# EAGLE design rgbboard (EAGLE 7.7.0)
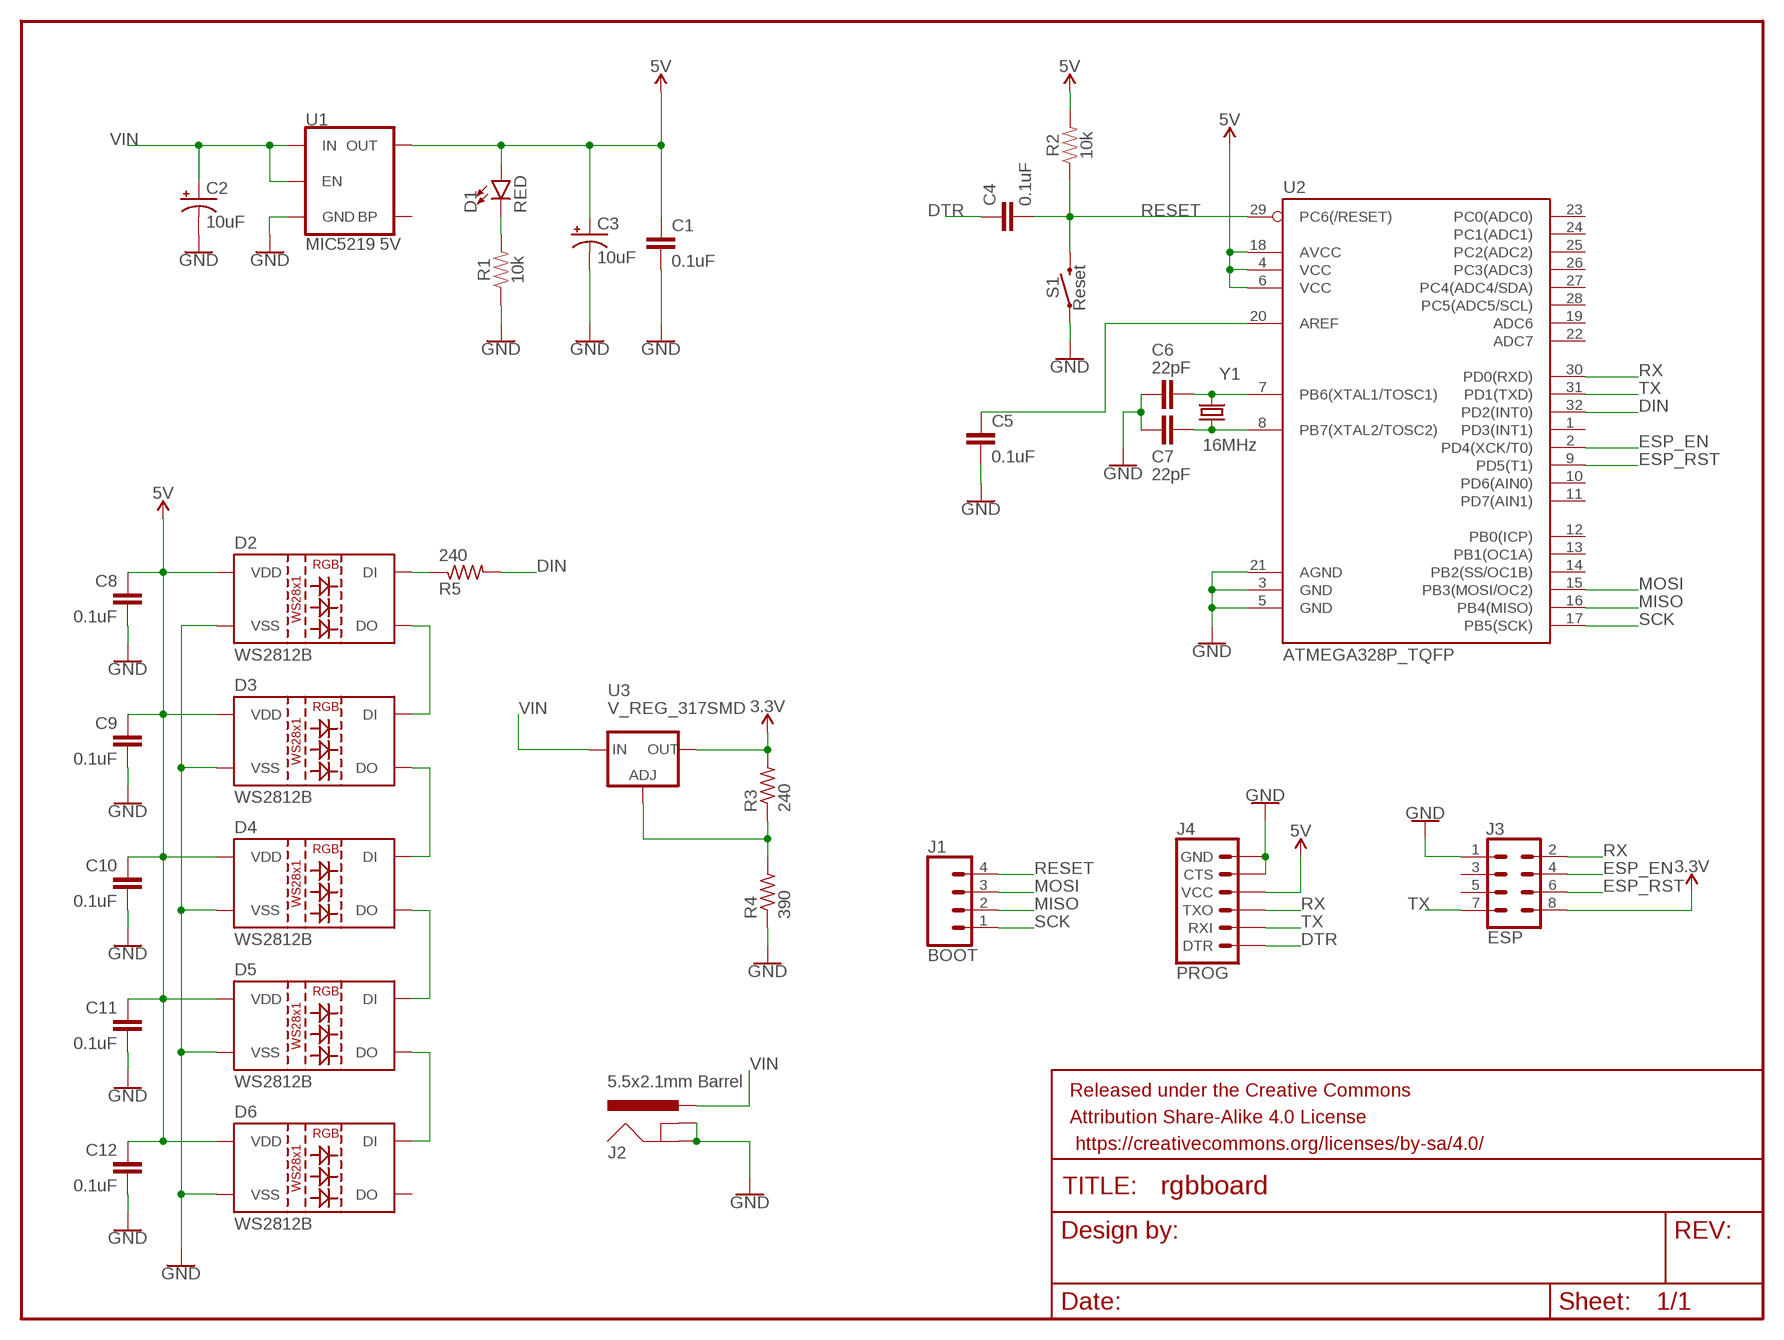
[diagram p0: schematic, sheet 1]

## Parts
C1  0.1uF  0.1UF-0603-25V-5%  [0603]
C2  10uF  10UF-POLAR-EIA3216-16V-10%(TANT)  [EIA3216]
C3  10uF  10UF-POLAR-EIA3216-16V-10%(TANT)  [EIA3216]
C4  0.1uF  0.1UF-0603-25V-5%  [0603]
C5  0.1uF  0.1UF-0603-25V-5%  [0603]
C6  22pF  22PF-0603-50V-5%  [0603]
C7  22pF  22PF-0603-50V-5%  [0603]
C8  0.1uF  0.1UF-0603-25V-5%  [0603]
C9  0.1uF  0.1UF-0603-25V-5%  [0603]
C10  0.1uF  0.1UF-0603-25V-5%  [0603]
C11  0.1uF  0.1UF-0603-25V-5%  [0603]
C12  0.1uF  0.1UF-0603-25V-5%  [0603]
D1  RED  LED-RED0603  [LED-0603]
D2  WS2812B  [WS2812B]
D3  WS2812B  [WS2812B]
D4  WS2812B  [WS2812B]
D5  WS2812B  [WS2812B]
D6  WS2812B  [WS2812B]
FRAME1  FRAME-LETTER  [CREATIVE_COMMONS]
J1  BOOT  CONN_04  [1X04]
J2  5.5x2.1mm Barrel  POWER_JACKSMD  [POWER_JACK_SMD]
J3  ESP  CONN_04X2  [2X4]
J4  PROG  6_PIN_SERIAL_TARGET  [1X06]
R1  10k  10KOHM-0603-1/10W-1%  [0603]
R2  10k  10KOHM-0603-1/10W-1%  [0603]
R3  240  R-US_R0603  [R0603]
R4  390  R-US_R0603  [R0603]
R5  240  R-US_R0603  [R0603]
S1  Reset  MOMENTARY-SWITCH-SPST-SMD-5.2-REDUNDANT  [TACTILE_SWITCH_SMD_5.2MM]
U1  MIC5219 5V  V_REG_MIC52195V  [SOT23-5]
U2  ATMEGA328P_TQFP  [TQFP32-08]
U3  V_REG_317SMD  [SOT223]
Y1  16MHz  CRYSTAL-16MHZSMD-5X3.2  [CRYSTAL-SMD-5X3.2-4PAD]

## Nets
3.3V: J3.8 R3.2 U3.2(OUT)
5V: C1.1 C3.+ C8.1 C9.1 C10.1 C11.1 C12.1 D1.A D2.1(VDD) D3.1(VDD) D4.1(VDD) D5.1(VDD) D6.1(VDD) J4.4(VCC) R2.2 U1.5(OUT) U2.4(VCC) U2.6(VCC) U2.18(AVCC)
DIN: R5.2 U2.32(PD2(INT0))
DTR: C4.1 J4.1(DTR)
ESP_EN: J3.4 U2.2(PD4(XCK/T0))
ESP_RST: J3.6 U2.9(PD5(T1))
GND: C1.2 C2.- C3.- C5.2 C6.1 C7.1 C8.2 C9.2 C10.2 C11.2 C12.2 D2.3(VSS) D3.3(VSS) D4.3(VSS) D5.3(VSS) D6.3(VSS) J2.GND(GNDBREAK) J2.P$4(GND) J3.1 J4.5(CTS) J4.6(GND) R1.1 R4.1 S1.1 S1.2 U1.2(GND) U2.3(GND) U2.5(GND) U2.21(AGND)
MISO: J1.2 U2.16(PB4(MISO))
MOSI: J1.3 U2.15(PB3(MOSI/OC2))
N$1: D2.2(DO) D3.4(DI)
N$2: D1.C R1.2
N$3: D3.2(DO) D4.4(DI)
N$4: D4.2(DO) D5.4(DI)
N$5: D5.2(DO) D6.4(DI)
N$7: C5.1 U2.20(AREF)
N$8: C6.2 U2.7(PB6(XTAL1/TOSC1)) Y1.3
N$9: C7.2 U2.8(PB7(XTAL2/TOSC2)) Y1.1
N$10: R3.1 R4.2 U3.1(ADJ)
N$11: D2.4(DI) R5.1
RESET: C4.2 J1.4 R2.1 S1.3 S1.4 U2.29(PC6(/RESET))
RX: J3.2 J4.3(TXO) U2.30(PD0(RXD))
SCK: J1.1 U2.17(PB5(SCK))
TX: J3.7 J4.2(RXI) U2.31(PD1(TXD))
VIN: C2.+ J2.VIN0(PWR) U1.1(IN) U1.3(EN) U3.3(IN)
Unconnected: D6.2(DO) J3.3 J3.5 U1.4(BP) U2.1(PD3(INT1)) U2.10(PD6(AIN0)) U2.11(PD7(AIN1)) U2.12(PB0(ICP)) U2.13(PB1(OC1A)) U2.14(PB2(SS/OC1B)) U2.19(ADC6) U2.22(ADC7) U2.23(PC0(ADC0)) U2.24(PC1(ADC1)) U2.25(PC2(ADC2)) U2.26(PC3(ADC3)) U2.27(PC4(ADC4/SDA)) U2.28(PC5(ADC5/SCL))

## Library data of the parts
C1 C4 C5 C8-C12 = SparkFun-Capacitors:0.1UF: 0.1µF ceramic capacitors A capacitor is a passive two-terminal electrical component used to store electrical energy temporarily in an electric field.; PROD_ID: CAP-08604
C2 C3 = SparkFun-Capacitors:10UF-POLAR: 10.0µF polarized capacitors A capacitor is a passive two-terminal electrical component used to store electrical energy temporarily in an electric field.; PROD_ID: CAP-00811
C6 C7 = SparkFun-Capacitors:22PF: 22pF ceramic capacitors A capacitor is a passive two-terminal electrical component used to store electrical energy temporarily in an electric field.; PROD_ID: CAP-07876
D1 = SparkFun-LED:LED-RED: Red SMD LED Used in manufacturing of most products at SparkFun Packages: 0603 - SMD 0603 package [Product Link] <http://docs.avagotech.com/docs/AV02-0551EN> 0603 SMART - SMD 0603 SMART package ( more efficient and expensive)[Product Link] <http://www.osram-os.com/Graphics/XPic2/00077099_0.pdf> 1206 - SMD1206 package [Product Link] <https://www.sparkfun.com/datasheets/DevTools/LilyPad/Q150OVS4.pdff> SparkFun Products: Pro Mini 328 -5V <https://www.sparkfun.com/products/821> RedBoard <https://www.sparkfun.com/products/12757> IOIO-OTG <https://www.sparkfun.com/products/13613>; PROD_ID: DIO-00819
D2-D6 = SparkFun-LED:WS2812B: WS2812B SMD addressable RGB LED 5x5mm SMD LED with built-in controller IC. Color: Red/Green/Blue mC Rating: RGB: 390, 660, 180 mcd Forward Voltage: RGB: 2.0, 3.0, 3.0 V Packages:WS2812B SparkFun Products: Blynk Board - ESP8266 <https://www.sparkfun.com/products/13794>; PROD_ID: DIO-12503
FRAME1 = SparkFun-Aesthetics:FRAME-LETTER: Schematic Frame - Letter Standard 8.5x11 US Letter frame
J1 = SparkFun-Connectors:CONN_04: Multi connection point. Often used as Generic Header-pin footprint for 0.1 inch spaced/style header connections On any of the 0.1 inch spaced packages, you can populate with these: Break Away Headers - Straight <https://www.sparkfun.com/products/116> (PRT-00116) Break Away Male Headers - Right Angle <https://www.sparkfun.com/products/553> (PRT-00553) Female Headers <https://www.sparkfun.com/products/115> (PRT-00115) Break Away Headers - Machine Pin <https://www.sparkfun.com/products/117> (PRT-00117) Break Away Female Headers - Swiss Machine Pin <https://www.sparkfun.com/products/743> (PRT-00743) For SCREWTERMINALS and SPRING TERMINALS visit here: Screw Terimnals on SparkFun.com <https://www.sparkfun.com/search/results?term=Screw+Terminals> (5mm/3.5mm/2.54mm spacing) This device is also useful as a general connection point to wire up your design to another part of your project. Our various solder wires solder well into these plated through hole pads. Hook-Up Wire - Assortment (Stranded, 22 AWG) <https://www.sparkfun.com/products/11375> (PRT-11375) Hook-Up Wire - Assortment (Solid Core, 22 AWG) <https://www.sparkfun.com/products/11367> (PRT-11367) View the entire wire category on our website here <https://www.sparkfun.com/categories/141> Special notes: Molex polarized connector foot print use with SKU : PRT-08231 with associated crimp pins and housings. 1MM SMD Version SKU: PRT-10208; PROD_ID: CONN-09696
J2 = SparkFun-Connectors:POWER_JACK: Power Jack Connector This is the standard 5.5mm barrel jack for power. The PTH is the most common, proven, reliable, footprint. The Slot footprint only works if the mill layer is transmitted to the PCB fab house so be warned. Here are the connectors we sell at SparkFun: DC Barrel Power Jack/Connector <https://www.sparkfun.com/products/119> (PRT-00119) DC Barrel Power Jack/Connector (SMD) <https://www.sparkfun.com/products/12748> (PRT-12748) DC Barrel Jack Adapter - Breadboard Compatible <https://www.sparkfun.com/products/10811> (PRT-10811) It is used on this SparkFun product (and many, many others): SparkFun RedBoard - Programmed with Arduino <https://www.sparkfun.com/products/12757> (DEV-12757) Also, if you need a mating power supply or connector, please check these out: Wall Adapter Power Supply - 9VDC 650mA <https://www.sparkfun.com/products/298> (TOL-00298) DC Barrel Jack Adapter - Male <https://www.sparkfun.com/products/10287> (PRT-10287); PROD_ID: CONN-08106; SF_ID: PRT-12748
J3 = SparkFun-Connectors:CONN_04X2: Multi connection point. Often used as Generic Header-pin footprint for 0.1 inch spaced/style header connections On any of the 0.1 inch spaced packages, you can populate with these: Break Away Headers - Straight <https://www.sparkfun.com/products/116> (PRT-00116) Break Away Male Headers - Right Angle <https://www.sparkfun.com/products/553> (PRT-00553) Female Headers <https://www.sparkfun.com/products/115> (PRT-00115) Break Away Headers - Machine Pin <https://www.sparkfun.com/products/117> (PRT-00117) Break Away Female Headers - Swiss Machine Pin <https://www.sparkfun.com/products/743> (PRT-00743)
J4 = SparkFun-Connectors:6_PIN_SERIAL_TARGET: 6-pin header connection for use with the "FTDI BASIC" pinout - TARGET SIDE. Also known as "Arduino Serial Program Header". It is used to mate with our FTDI Basic serial programmers using the Arduino IDE. Note, this device has "TARGET" in the name. It is intended to be used on a design that contains a target micro-controller that you wish to program. The "sister" device, named "CABLE" is inteneded to be used on a design that usually lives on the end of your USB cable and prvides the converter chip (FTDI232 or FTDI231x) to commnicate serial RX/TX. You can populate with some of these: Break Away Headers - Straight <https://www.sparkfun.com/products/116> (PRT-00116) For reference (or to suit your programming needs) check out these designs: SparkFun FTDI Basic Breakout - 5V <https://www.sparkfun.com/products/9716> (DEV-09716) SparkFun FTDI Basic Breakout - 3.3V <https://www.sparkfun.com/products/9873> (DEV-09873) SparkFun FTDI SmartBasic <https://www.sparkfun.com/products/12935> (DEV-12935) SparkFun Beefy 3 - FTDI Basic Breakout <https://www.sparkfun.com/products/13746> (DEV-13746)
R1 R2 = SparkFun-Resistors:10KOHM: 10kΩ resistor A resistor is a passive two-terminal electrical component that implements electrical resistance as a circuit element. Resistors act to reduce current flow, and, at the same time, act to lower voltage levels within circuits. - Wikipedia; PROD_ID: RES-00824
R3-R5 = resistor:R-US_: RESISTOR, American symbol
S1 = SparkFun-Switches:MOMENTARY-SWITCH-SPST: Momentary Switch (Pushbutton) - SPST Normally-open (NO) SPST momentary switches (buttons, pushbuttons). Variants PTH-12MM - 12mm square, through-hole Momentary Pushbutton Switch - 12mm Square <https://www.sparkfun.com/products/9190> (COM-09190) PTH-6.0MM, PTH-6.0MM-KIT - 6.0mm square, through-hole Mini Pushbutton Switch <https://www.sparkfun.com/products/97> (COM-00097) KIT package intended for soldering kit's - only one side of pads' copper is exposed. PTH-RIGHT-ANGLE-KIT - Right-angle, through-hole Right Angle Tactile Button <https://www.sparkfun.com/products/10791> - Used on SparkFun BigTime Watch Kit <https://www.sparkfun.com/products/11734> SMD-12MM - 12mm square, surface-mount Tactile Button - SMD (12mm) <https://www.sparkfun.com/products/12993> (COM-12993) Used on SparkFun PicoBoard <https://www.sparkfun.com/products/11888> SMD-4.5MM - 4.5mm Square Trackball Switch Used on SparkFun Blackberry Trackballer Breakout <https://www.sparkfun.com/products/13169> SMD-4.6MMX2.8MM - 4.60mm x 2.80mm, surface mount Used on SparkFun SAMD21 Mini Breakout <https://www.sparkfun.com/products/13664> SMD-5.2MM, SMD-5.2-REDUNDANT - 5.2mm square, surface-mount Mini Pushbutton Switch - SMD <https://www.sparkfun.com/products/8720> (COM-08720) Used on Arduino Pro Mini <https://www.sparkfun.com/products/11114> REDUNDANT package connects both switch circuits together SMD-6.0X3.5MM - 6.0 x 3.5mm, surface mount Momentary Reset Switch SMD <https://www.sparkfun.com/products/8229> (COM-08229) SMD-6.2MM-TALL - 6.2mm square, surface mount Tactile Button - SMD (6mm) <https://www.sparkfun.com/products/12992> Used on SparkFun Digital Sandbox <https://www.sparkfun.com/products/12651> SMD-RIGHT-ANGLE - Right-angle, surface mount Used on SparkFun Block for Intel® Edison - Arduino <https://www.sparkfun.com/products/13036>; PROD_ID: SWCH-08247; SF_SKU: COM-08720
U1 = SparkFun-IC-Power:V_REG_MIC5219: V_REG MIC5219 Standard 3.3V and 5V 500mA LDO voltage regulator in SOT-23 layout. Micrel part MIC5219. BP (by-pass) pin is used to lower output noise with 470pF cap, may be left open.; PROD_ID: VREG-10107
U2 = SparkFun-IC-Microcontroller:ATMEGA328P_TQFP: Popular 328P in QFP Storefront component: ATmega328 - TQFP <https://www.sparkfun.com/products/13448> (COM-13448) Datasheet <http://www.sparkfun.com/datasheets/Components/SMD/ATMega328.pdf> SparkFun Products SparkFun RedBoard - Programmed with Arduino <https://www.sparkfun.com/products/12757> (DEV-12757) Arduino Pro Mini 328 - 5V/16MHz <https://www.sparkfun.com/products/11113> (DEV-11113) Arduino Pro Mini 328 - 3.3V/8MHz <https://www.sparkfun.com/products/11114> (DEV-11114) SparkFun OpenLog <https://www.sparkfun.com/products/13712> (DEV-13712) SparkFun MicroView - OLED Arduino Module <https://www.sparkfun.com/products/12923> (DEV-12923) SparkFun Digital Sandbox <https://www.sparkfun.com/products/12651> (DEV-12651) SparkFun PicoBoard <https://www.sparkfun.com/products/11888> (WIG-11888) Arduino Fio <https://www.sparkfun.com/products/10116> (DEV-10116) LilyPad Arduino 328 Main Board <https://www.sparkfun.com/products/13342> (DEV-13342) SparkFun RedStick <https://www.sparkfun.com/products/13741> (DEV-13741) LilyPad MP3 <https://www.sparkfun.com/products/11013> (DEV-11013) LilyPad Arduino SimpleSnap <https://www.sparkfun.com/products/10941> (DEV-10941) SparkFun Stepoko <https://www.sparkfun.com/products/13899> (ROB-13899) SparkFun Geiger Counter <https://www.sparkfun.com/products/11345> (SEN-11345) SparkFun EL Sequencer <https://www.sparkfun.com/products/12781> (COM-12781) Arduino Pro 328 - 5V/16MHz <https://www.sparkfun.com/products/10915> (DEV-10915) CryptoCape <https://www.sparkfun.com/products/12773> (DEV-12773) SparkFun IR Thermometer Evaluation Board - MLX90614 <https://www.sparkfun.com/products/10740> (SEN-10740) SparkFun RedBot Mainboard <https://www.sparkfun.com/products/12097> (ROB-12097) Arduino Pro 328 - 3.3V/8MHz <https://www.sparkfun.com/products/10914> (DEV-10914) SparkFun Block for Intel® Edison - Arduino <https://www.sparkfun.com/products/13036> (DEV-13036) SparkFun Simon Says - Surface Mount Soldering Kit <https://www.sparkfun.com/products/10935> (KIT-10935) SparkFun 7-Segment Serial Display - Red <https://www.sparkfun.com/products/11441> (COM-11441) SparkFun 7-Segment Serial Display - White <https://www.sparkfun.com/products/11629> (COM-11629) SparkFun 7-Segment Serial Display - Yellow <https://www.sparkfun.com/products/11443> (COM-11443) SparkFun 7-Segment Serial Display - Kelly Green <https://www.sparkfun.com/products/11440> (COM-11440) SparkFun 7-Segment Serial Display - Blue <https://www.sparkfun.com/products/11442> (COM-11442) SparkFun OpenSegment Serial Display - 20mm (Blue) <https://www.sparkfun.com/products/11647> (COM-11647) SparkFun OpenSegment Serial Display - 20mm (Green) <https://www.sparkfun.com/products/11646> (COM-11646) SparkFun OpenSegment Serial Display - 20mm (White) <https://www.sparkfun.com/products/11648> (COM-11648) SparkFun OpenSegment Serial Display - 20mm (Red) <https://www.sparkfun.com/products/11644> (COM-11644) SparkFun OpenSegment Serial Display - 20mm (Yellow) <https://www.sparkfun.com/products/11645> (COM-11645) SparkFun OpenSegment Shield <https://www.sparkfun.com/products/13190> (DEV-13190); PROD_ID: IC-09069
U3 = SparkFun-IC-Power:V_REG_317: Voltage Regulator Standard LM317 adjustable voltage regulator. AOI (Adjust Output Input). Google 'LM317 Calculator' for easy to use app to get the two resistor values needed. 240/720 for 5V output. 240/390 for 3.3V output. Spark Fun Electronics SKU : COM-00527
Y1 = SparkFun-Clocks:CRYSTAL-16MHZ: 16MHz Crystal Digikey Example <http://www.digikey.com/product-search/en?keywords=535-9122-1-ND> Frequency: 16MHz Frequency Stability: ±50ppm Frequency Tolerance: ±20ppm Load Capacitance: 18pF SparkFun Products: Pro Micro -5V/16MHz <https://www.sparkfun.com/products/12640> SparkFun Serial Enabled LCD Kit <https://www.sparkfun.com/products/10097>; PROD_ID: XTAL-08218; SF_ID: COM-00094

## Net classes
0 5V: width 0.203 mm

## Board
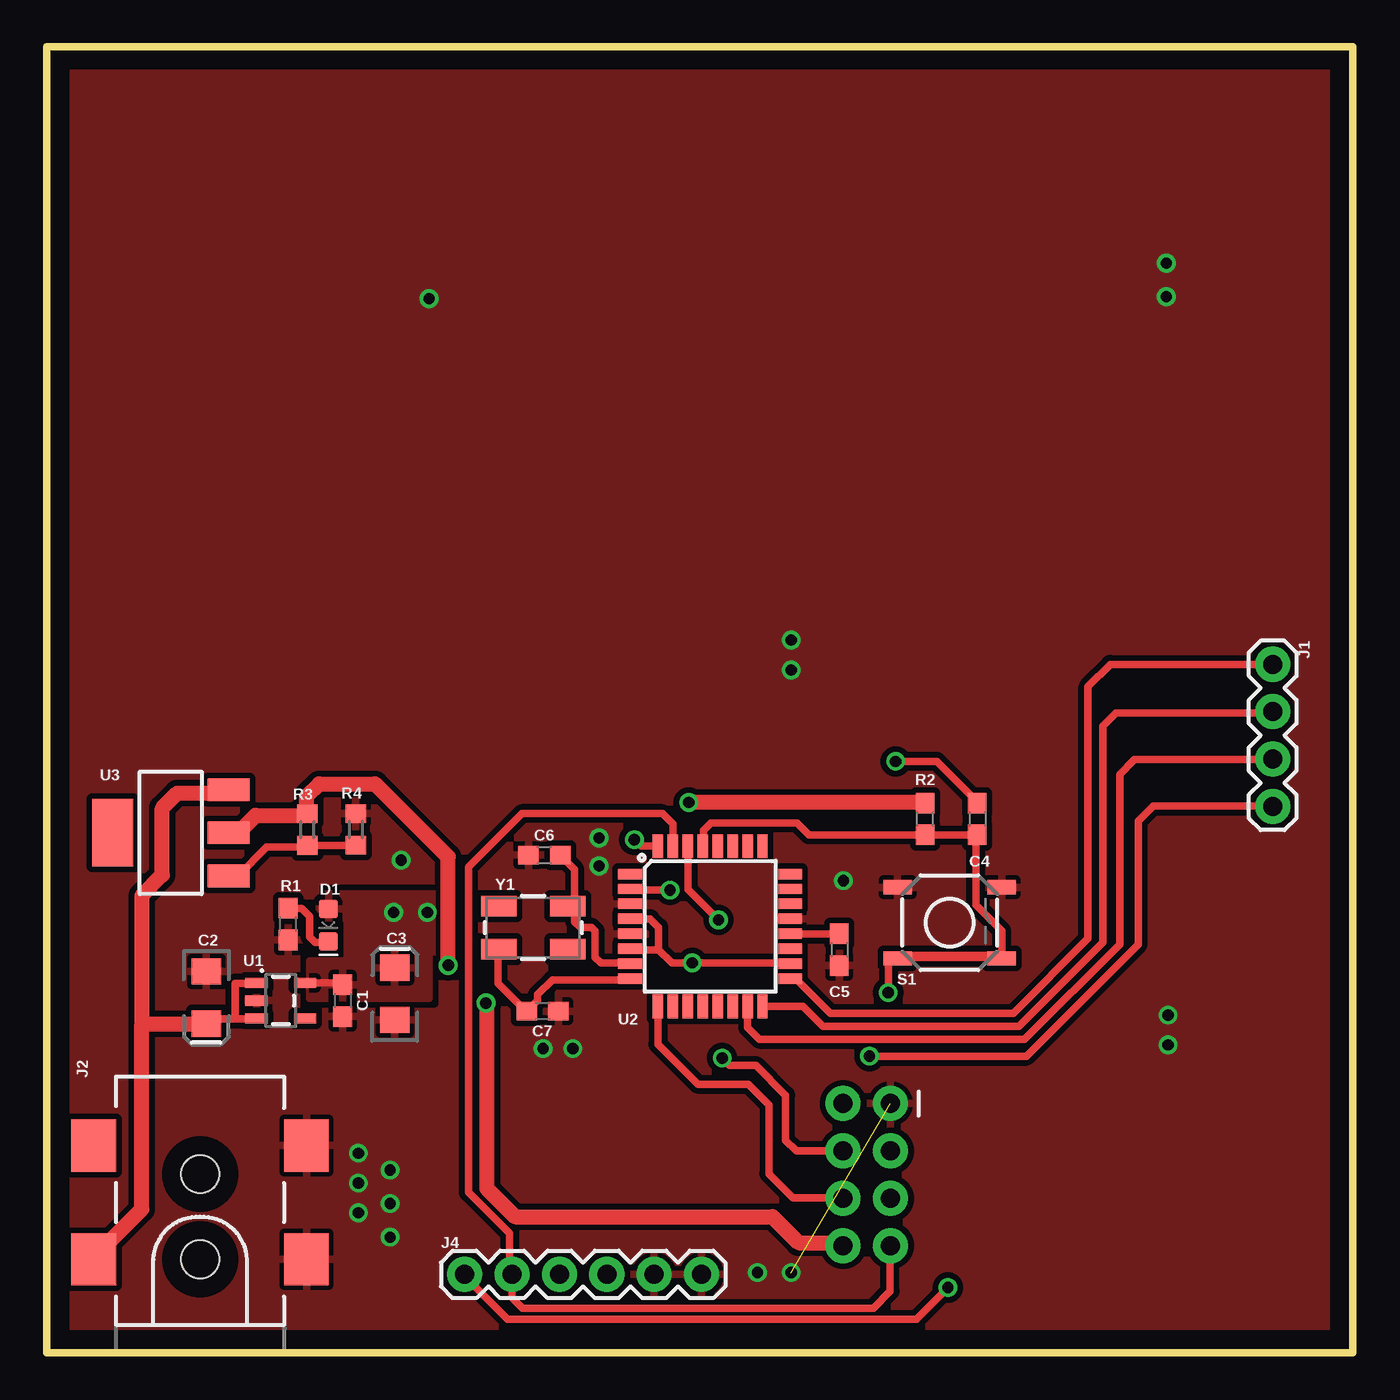
[diagram p1: board, top side]
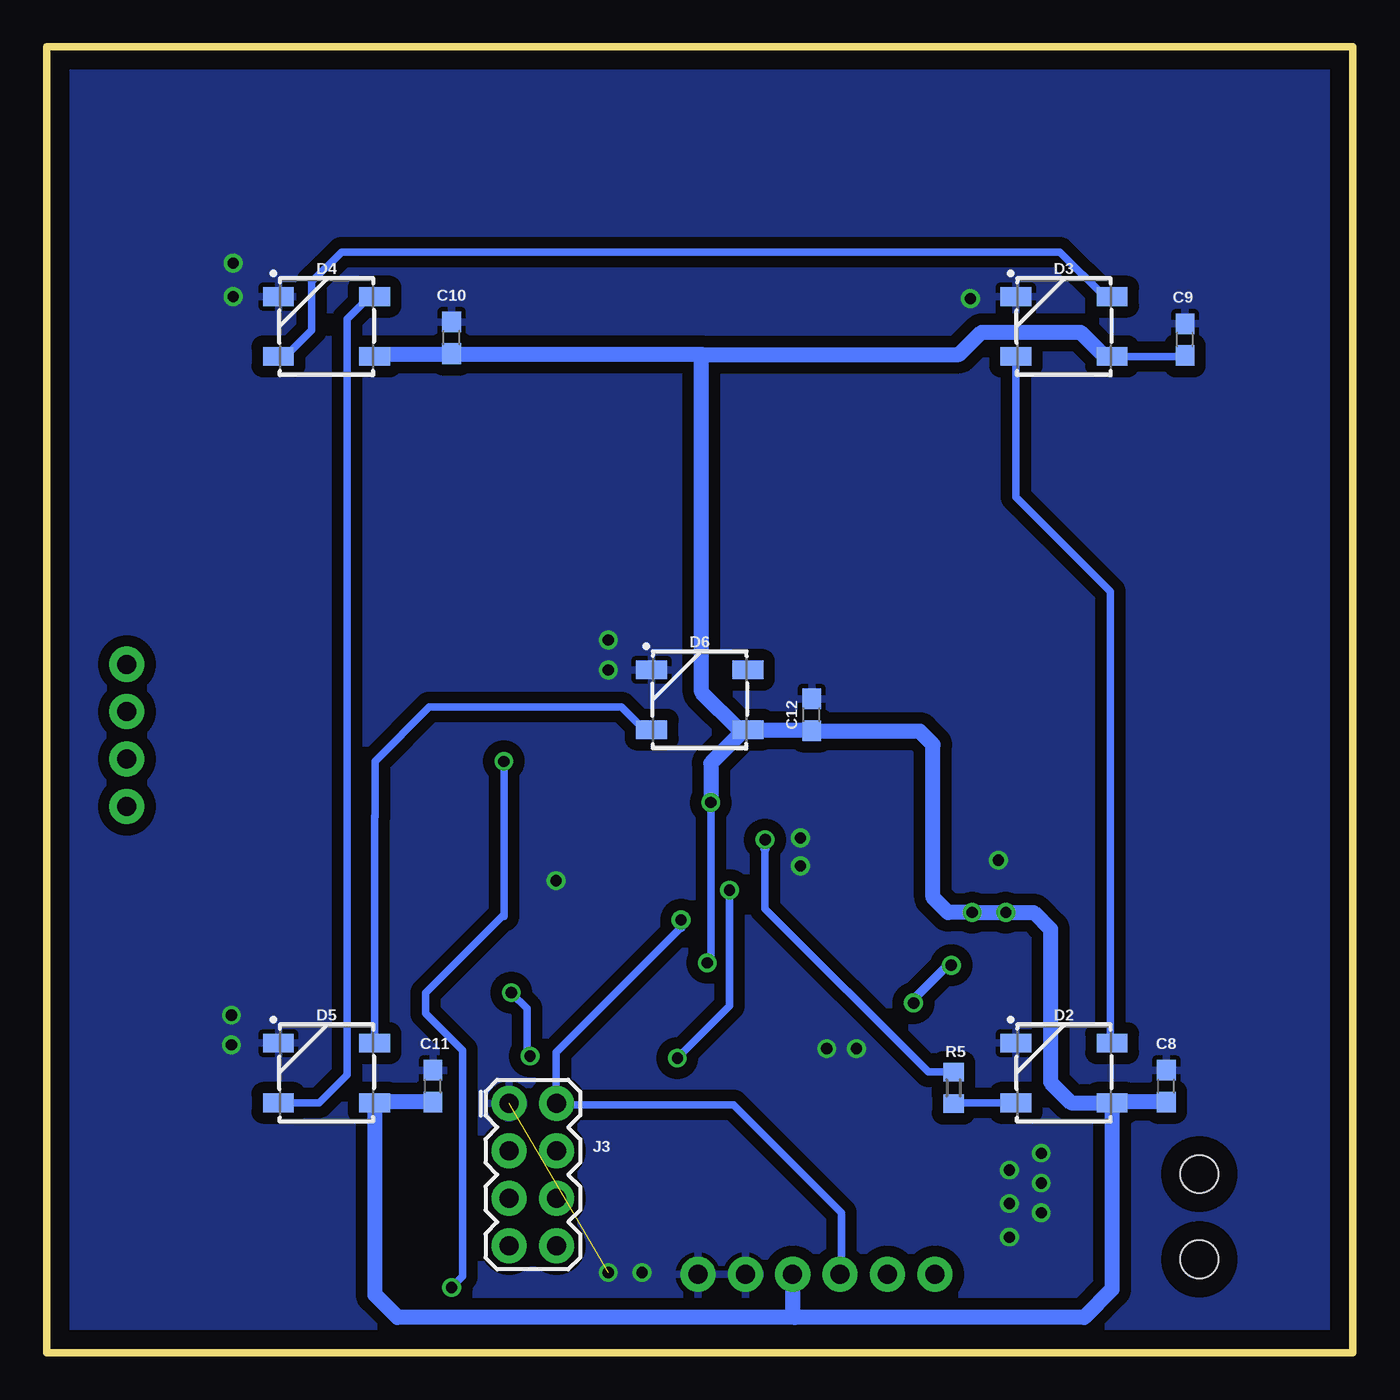
[diagram p2: board, bottom side, seen from below]

Size 70 x 70 mm. Coordinates in mm from the lower left corner, seen from the top.
Outline: 0,0 70,0 70,70 0,70 0,0
Copper layers (1*16): Top 0.035mm / dielectric 1.5mm / Bottom 0.035mm
Design rules "default *": minimum track width 6mil, minimum drill 3mil, track to track 6mil, track to pad 6mil, pad to pad 6mil, via to via 6mil, smd to smd 6mil, copper to edge 40mil, drill to drill 6mil, minimum pad ring 10mil, minimum via ring 8mil, stop-mask expansion 4mil, vias tented up to drill 0mil, thermal gap 10mil

### Footprints (pad centres in the part's own frame; a part is rotated, then mirrored left to right if it is on the bottom)
0603 = smd 1.1 x 1: 1 -0.85,0; 2 0.85,0
EIA3216 = smd 1.4 x 1.6: + 1.4,0; - -1.4,0
LED-0603 = smd 1 x 1: A -0.877,0; C 0.877,0
WS2812B = smd 1.651 x 1: 1 2.577,-1.6; 2 2.577,1.6; 3 -2.577,1.6; 4 -2.577,-1.6
1X04 = drill 1.016 pad 1.88: 1 0,0; 2 2.54,0; 3 5.08,0; 4 7.62,0
POWER_JACK_SMD = smd 2.8 x 2.4: GND 0,-5.7; P$4 6.1,-5.7; VIN0 0,5.7; VIN1 6.1,5.7 | hole 2.032: 0,0; 4.572,0
2X4 = drill 1.016 pad 1.88: 1 -3.81,-1.27; 2 -3.81,1.27; 3 -1.27,-1.27; 4 -1.27,1.27; 5 1.27,-1.27; 6 1.27,1.27; 7 3.81,-1.27; 8 3.81,1.27
1X06 = drill 1.016 pad 1.88: 1 0,0; 2 2.54,0; 3 5.08,0; 4 7.62,0; 5 10.16,0; 6 12.7,0
R0603 = smd 1 x 1.1: 1 -0.85,0; 2 0.85,0
TACTILE_SWITCH_SMD_5.2MM = smd 1.524 x 0.762: 1 -2.794,1.905; 2 2.794,1.905; 3 -2.794,-1.905; 4 2.794,-1.905
SOT23-5 = smd 0.55 x 1.2: 1 -0.95,-1.3; 2 0,-1.3; 3 0.95,-1.3; 4 0.95,1.3; 5 -0.95,1.3
TQFP32-08 = smd 1.27 x 0.559: 1 -4.293,2.8; 2 -4.293,2; 3 -4.293,1.2; 4 -4.293,0.4; 5 -4.293,-0.4; 6 -4.293,-1.2; 7 -4.293,-2; 8 -4.293,-2.8; 17 4.293,-2.8; 18 4.293,-2; 19 4.293,-1.2; 20 4.293,-0.4; 21 4.293,0.4; 22 4.293,1.2; 23 4.293,2; 24 4.293,2.8 | smd 0.559 x 1.27: 9 -2.8,-4.293; 10 -2,-4.293; 11 -1.2,-4.293; 12 -0.4,-4.293; 13 0.4,-4.293; 14 1.2,-4.293; 15 2,-4.293; 16 2.8,-4.293; 25 2.8,4.293; 26 2,4.293; 27 1.2,4.293; 28 0.4,4.293; 29 -0.4,4.293; 30 -1.2,4.293; 31 -2,4.293; 32 -2.8,4.293
SOT223 = smd 1.219 x 2.235: 1 -2.311,-3.099; 2 0,-3.099; 3 2.311,-3.099 | smd 3.6 x 2.2: 4 0,3.099
CRYSTAL-SMD-5X3.2-4PAD = smd 1.9 x 1.1: 1 -1.85,-1.15; 2 1.85,-1.15; 3 1.85,1.15; 4 -1.85,1.15

### Placement (x,y rotation side)
C1  15.86,18.88 270 top
C2  8.56,19.04 270 top
C3  18.66,19.24 90 top
C4  49.87,28.61 270 top
C5  42.48,21.61 270 top
C6  26.67,26.67 0 top
C7  26.57,18.31 180 top
C8  10,14.3 90 bottom
C9  9,54.3 90 bottom
C10  48.3,54.4 90 bottom
C11  49.3,14.3 90 bottom
C12  29,34.2 90 bottom
D1  15.1,22.92 270 top
D2  15.48,15 0 bottom
D3  15.48,55 0 bottom
D4  55,55 0 bottom
D5  55,15 0 bottom
D6  35,35 0 bottom
FRAME1  -101.6,25.4 0 top  (outside the outline)
J1  65.7,36.9 270 top
J2  8.22,5.01 90 top
J3  43.95,9.55 270 bottom
J4  22.4,4.2 0 top
R1  12.94,22.98 90 top
R2  47.08,28.61 90 top
R3  13.97,28.04 90 top
R4  16.57,28.05 270 top
R5  21.4,14.2 90 bottom
S1  48.39,23.05 0 top
U1  12.55,18.88 270 top
U2  35.56,22.86 0 top
U3  6.65,27.87 90 top
Y1  26.07,22.79 0 top

### Tracks (layer width: path | path; a pad name or v marks a point on that pad's centre or on a via)
3.3V  (via drill 0.61)
  Top 0.406: 13.78,28.7 R3.2 13.88,28.8 | 23.6,18.69 v23.55,18.75 | 42.52,5.9 J3.8 | U3.2 10.27,27.87
  Top 0.508: R3.2 14,29 13.95,29.03
  Top 0.813: 23.6,18.69 23.6,8.8 25.1,7.3 38.9,7.3 40.3,5.9 42.52,5.9 | 13.95,29.03 13.95,29.84 14.6,30.5 17.6,30.5 21.52,26.58 v21.52,20.77 | 10.27,27.87 11.2,28.8 13.88,28.8
  Bottom 0.508: v21.52,20.77 21.75,20.75 23.5,19 23.5,18.75 v23.55,18.75
5V  (via drill 0.6)
  Top 0.406: 46.86,29.49 R2.2 | U2.18 39.81,20.9 v34.6,20.9 33.5,20.9 32.8,21.6 | 32.8,21.6 31.33,21.6 U2.6 | 32.8,21.6 32.8,22.8 32.34,23.26 U2.4 | U1.5 15.76,19.83 C1.1
  Top 0.813: 46.86,29.49 v34.41,29.49
  Bottom 0.406: v34.6,20.9 34.41,21.09 v34.41,29.49 v34.4,29.5 | 32.42,33.35 D6.1 32.9,33.4 32.9,33.1 | 35,53.5 34.9,53.4 34.9,53.5 | 52.32,53.5 D4.1 | D3.1 9.05,53.4 C9.1 | 52.4,13.38 D5.1 52.37,13.45 | 30.02,2.02 29.9,1.9 | 12.4,13.45 12.85,13.45 D2.1 12.45,13.4 12.4,13.45
  Bottom 0.508: 48.5,53.5 C10.1 | C12.1 29,33.5 28.95,33.3 | D3.1 13,53.5 13.5,53.5 13.5,53.6
  Bottom 0.813: C8.1 12.4,13.45 | 28.95,33.3 23.2,33.3 22.5,32.6 22.5,24.4 21.7,23.6 v20.4,23.6 17.1,23.6 16.2,22.7 16.2,14.5 15.1,13.4 D2.1 12.9,3.4 14.4,1.9 29.9,1.9 51.2,1.9 52.4,3.1 52.4,13.38 | C12.1 32.42,33.35 | 32.9,33.4 34.9,35.4 34.9,53.4 | 35,53.5 48.5,53.5 52.32,53.5 | 13.5,53.6 14.6,54.7 19.9,54.7 21.1,53.5 34.9,53.5 | J4.4 30.02,2.02 | C11.1 52.37,13.45 | 32.9,33.1 34.4,31.6 v34.4,29.5
  other vias: 18.6,23.6
  pour Top (isolate 0.254): 14.1,19 14.1,21 16.1,21 16.1,22.9 16.1,23.3 14.6,23.3 14.6,24.6 20.9,24.6 20.9,21.5 20.5,21.5 20.5,19
DIN  (via drill 0.61)
  Top 0.406: U2.32 31.85,27.15 v31.5,27.5
  Bottom 0.406: 31.5,27 31.5,27.1 | 21.45,15.05 21.5,15.05 22.75,15.05 31.5,23.8 31.5,27
  Bottom 0.508: 31.5,27 v31.5,27.5 | 21.5,15.05 21.5,15 R5.2
DTR  (via drill 0.6)
  Top 0.406: 50.06,29.49 C4.1 49.87,29.53 47.7,31.7 v45.5,31.7 | J4.1 22.4,3.9 22.6,3.9 24.7,1.8 46.6,1.8 v48.3,3.5
  Bottom 0.406: v45.5,31.7 45.5,23.4 45.6,23.4 49.7,19.3 49.7,18.2 47.7,16.2 47.7,4.1 v48.3,3.5
ESP_EN  (via drill 0.6)
  Top 0.406: J3.4 40.18,10.82 39.6,11.4 39.6,13.8 38,15.4 36.6,15.4 v36.2,15.8 | U2.2 31.2,24.8 v33.4,24.8
  Bottom 0.406: v33.4,24.8 33.4,18.6 v36.2,15.8
ESP_RST
  Top 0.406: U2.9 32.76,16.54 34.9,14.4 37.6,14.4 38.7,13.3 38.7,9.6 40,8.3 42.66,8.3 J3.6
GND  (via drill 0.6, 0.6 pad 0.61)  (1 unrouted)
  other vias: 16.7,10.7 16.7,9.1 16.7,7.5 20.5,56.5 60,58.4 60,56.6 60.1,18.1 60.1,16.5 39.9,36.6 39.9,38.2 29.6,27.6 29.6,26.1 38.1,4.3 39.9,4.3 18.4,9.8 18.4,8 18.4,6.2 26.6,16.3 28.2,16.3 19,26.4 42.7,25.3
  pour Top (isolate 0.305, rank 2): 0,0 0,70 70,70 70,0
  pour Bottom (isolate 0.61): 0,0 0,70 70,70 70,0
MISO
  Top 0.406: U2.16 40.53,18.57 41.6,17.5 52.1,17.5 56.6,22 56.6,33.6 57.3,34.3 65.64,34.3 J1.2
MOSI
  Top 0.406: U2.15 37.56,17.44 38.2,16.8 52.4,16.8 57.5,21.9 57.5,31 58.3,31.8 65.68,31.8 J1.3
N$1
  Bottom 0.406: D3.4 18.06,45.86 13,40.8 13,16.7 D2.2
N$2
  Top 0.406: R1.2 13.67,23.83 14.1,23.4 14.1,22.3 14.4,22 15.06,22 D1.C
N$3
  Bottom 0.406: D3.2 13.3,56.6 15.7,59 54.2,59 55.8,57.4 55.8,54.8 57,53.6 57.38,53.6 D4.4
N$4
  Bottom 0.406: D4.2 52.7,56.6 53.9,55.4 53.9,14.9 55.4,13.4 D5.4
N$5
  Bottom 0.406: D5.2 52.42,28.7 | 52.42,28.7 52.42,28.78 | D6.4 38,33.4 39.2,34.6 49.5,34.6 52.4,31.7 52.4,28.72 52.42,28.7
N$7
  Top 0.406: U2.20 C5.1
N$8
  Top 0.406: C6.2 28.3,25.9 28.3,24.06 | 28.3,24.06 Y1.3 | 28.3,24.06 28.3,23.1 28.6,22.8 29.2,22.8 29.4,22.6 29.4,21.2 29.7,20.9 31.23,20.9 U2.7
N$9
  Top 0.406: U2.8 31.21,20 27.1,20 26.3,19.2 26.3,18.9 C7.2 25.69,18.31 24.2,19.8 24.2,21.62 Y1.1
N$10
  Top 0.406: R4.2 R3.1 13.88,27.1 11.8,27.1 10.26,25.56 U3.1
N$11
  Bottom 0.406: D2.4 21.35,13.4 R5.1
RESET  (via drill 0.6)
  Top 0.406: U2.29 35.2,27.19 35.2,28 35.6,28.4 40.2,28.4 40.84,27.76 R2.1 C4.2 49.8,27.69 49.8,24 51.18,22.62 S1.4 | J1.4 65.68,29.3 59.3,29.3 58.5,28.5 58.5,21.9 52.5,15.9 v44.1,15.9 | 45.5,21 45.1,21 v45.1,19.3
  Top 0.508: S1.4 51,21.25 45.75,21.25 S1.3 45.5,21
  Bottom 0.406: 44.25,16 44.25,17.75 44.25,18.45 v45.1,19.3
  Bottom 0.508: 44.25,16 v44.1,15.9
RX  (via drill 0.6)
  Top 0.406: U2.30 34.36,24.84 v36,23.2
  Bottom 0.406: 42.62,13.3 42.5,13.3 33.2,13.3 27.4,7.5 27.4,4.28 J4.3 | 36,22.8 42.7,16.1 42.7,13.38 J3.2
  Bottom 0.508: v36,23.2 36,23 36,22.8 | J3.2 42.5,13.5 42.5,13.3
SCK
  Top 0.406: U2.17 40.14,20.06 42,18.2 51.8,18.2 55.8,22.2 55.8,35.7 57,36.9 J1.1
TX
  Top 0.406: U2.31 33.56,28.34 33,28.9 25.47,28.9 22.6,26.03 22.6,8.6 24.8,6.4 24.8,4.34 J4.2 24.94,2.96 25.5,2.4 44.3,2.4 45.2,3.3 45.2,5.72 J3.7
VIN
  Top 0.406: 8.52,17.6 C2.+ 9,18 9.1,17.9 10.1,17.9 | J2.VIN0 2.52,5.12 | 9.57,30 U3.3 | 10.1,17.9 10.1,19.8 11.22,19.8 U1.1 | 10.1,17.9 11.22,17.9 U1.3
  Top 0.813: 2.52,5.12 5.1,7.7 5.1,17.64 | 9.57,30 7,30 6.2,29.2 6.2,25.6 5.1,24.5 5.1,17.64 | 5.1,17.64 C2.+